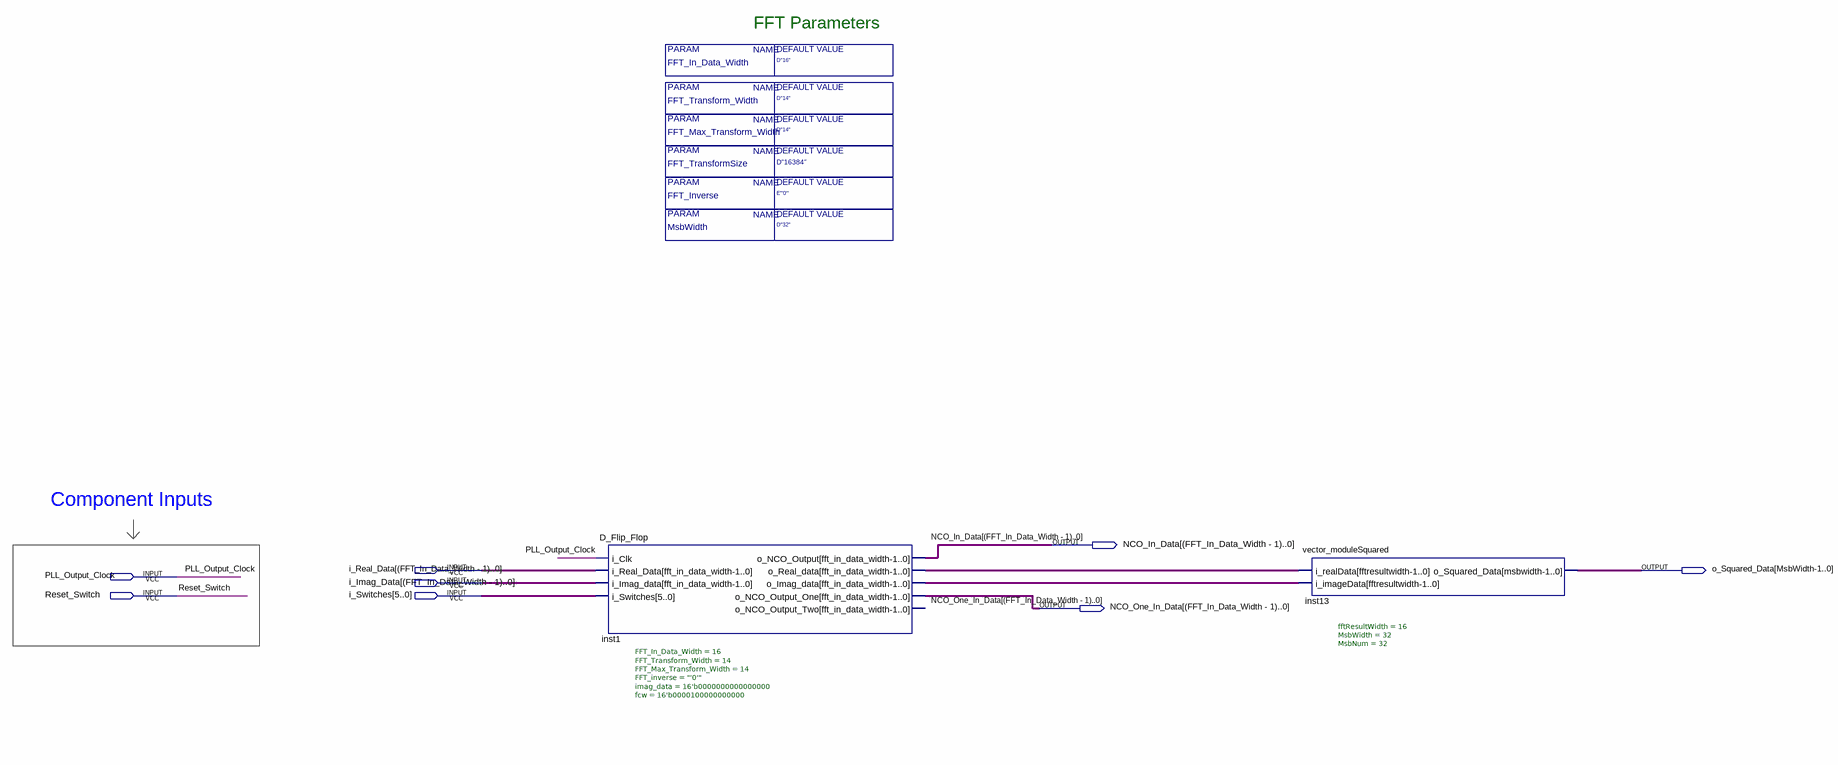
[diagram p0: schematic sheet]
// Quartus schematic FFT_Result_Calculator.bdf as structural Verilog: 2 symbols, 8 pins
module FFT_Result_Calculator #(parameter FFT_Inverse = "E\"'0'\"", parameter FFT_In_Data_Width = "D\"16\"", parameter FFT_Transform_Width = "D\"14\"", parameter FFT_Max_Transform_Width = "D\"14\"", parameter FFT_TransformSize = "D\"16384\"", parameter MsbWidth = "D\"32\"") (
  input  \i_Real_Data[(FFT_In_Data_Width_-_1)..0] ,
  input  PLL_Output_Clock,
  input  \i_Imag_Data[(FFT_In_Data_Width_-_1)..0] ,
  input  Reset_Switch,
  input  [5:0] i_Switches,
  output \NCO_In_Data[(FFT_In_Data_Width_-_1)..0] ,
  output \o_Squared_Data[MsbWidth-1..0] ,
  output \NCO_One_In_Data[(FFT_In_Data_Width_-_1)..0] 
);

  wire [15:0] inst1_o_imag_data, inst1_o_real_data, undriven, undriven_2;
  wire [31:0] inst13_o_squared_data;

  D_Flip_Flop #(.FFT_In_Data_Width(16), .FFT_Transform_Width(14), .FFT_Max_Transform_Width(14), .FFT_inverse("'0'"), .imag_data(16'b0000000000000000), .fcw(16'b0000100000000000)) inst1 (
    .i_Clk(PLL_Output_Clock), .i_Real_Data(undriven), .i_Imag_data(undriven_2), .i_Switches(i_Switches),
    .o_NCO_Output(\NCO_In_Data[(FFT_In_Data_Width_-_1)..0] ), .o_Real_data(inst1_o_real_data),
    .o_Imag_data(inst1_o_imag_data), .o_NCO_Output_One(\NCO_One_In_Data[(FFT_In_Data_Width_-_1)..0] ));  // open: o_NCO_Output_Two
  vector_moduleSquared #(.fftResultWidth(16), .MsbWidth(32), .MsbNum(32)) inst13 (
    .i_realData(inst1_o_real_data), .i_imageData(inst1_o_imag_data), .o_Squared_Data(inst13_o_squared_data));

  // Notes on the sheet:
  //   FFT Parameters
  //   Component Inputs   
endmodule
